# EAGLE design hackerspace_amped (EAGLE 5.12)
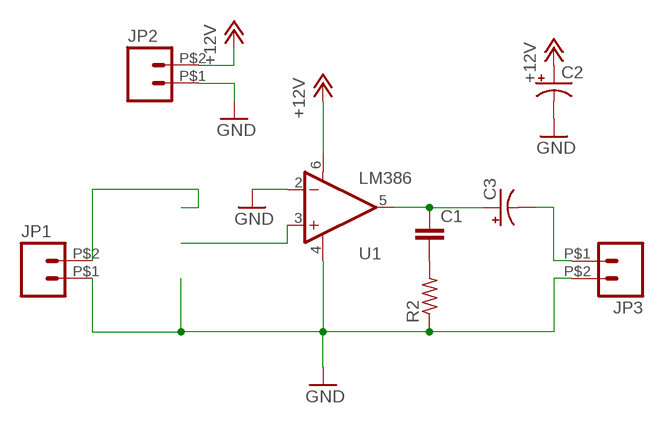
[diagram p0: schematic, sheet 1]

## Parts
C1  CAPPTH1  [CAP-PTH-5MM]
C2  CPOL-USE5-8.5  [E5-8,5]
C3  CPOL-USE22-6AXIAL  [E22-6]
JP1  M02PTH2  [1X02_BIG]
JP2  M02PTH2  [1X02_BIG]
JP3  M02PTH2  [1X02_BIG]
R2  R-US_0204/5  [0204/5]
U1  LM386  [DIP08]

## Nets
+12V: C2.+ JP2.P$2 U1.6(V+)
GND: C2.- JP1.P$1 JP2.P$1 JP3.P$2 R2.1 U1.2(-IN) U1.4(V-)
N$1: U1.3(+IN)
N$2: JP1.P$2
N$3: C1.1 C3.+ U1.5(OUT)
N$4: C3.- JP3.P$1
N$5: C1.2 R2.2

## Library data of the parts
C1 = SparkFun:CAP: Capacitor Standard 0603 ceramic capacitor, and 0.1" leaded capacitor.
C2 C3 = rcl:CPOL-US: POLARIZED CAPACITOR, American symbol
JP1-JP3 = SparkFun:M02: Header 2 Standard 2-pin 0.1" header. Use with straight break away headers (SKU : PRT-00116), right angle break away headers (PRT-00553), swiss pins (PRT-00743), machine pins (PRT-00117), and female headers (PRT-00115). Molex polarized connector foot print use with SKU : PRT-08233 with associated crimp pins and housings.
R2 = rcl:R-US_: RESISTOR, American symbol
U1 = SparkFun:LM386: low voltage audio power amplifier

## Board
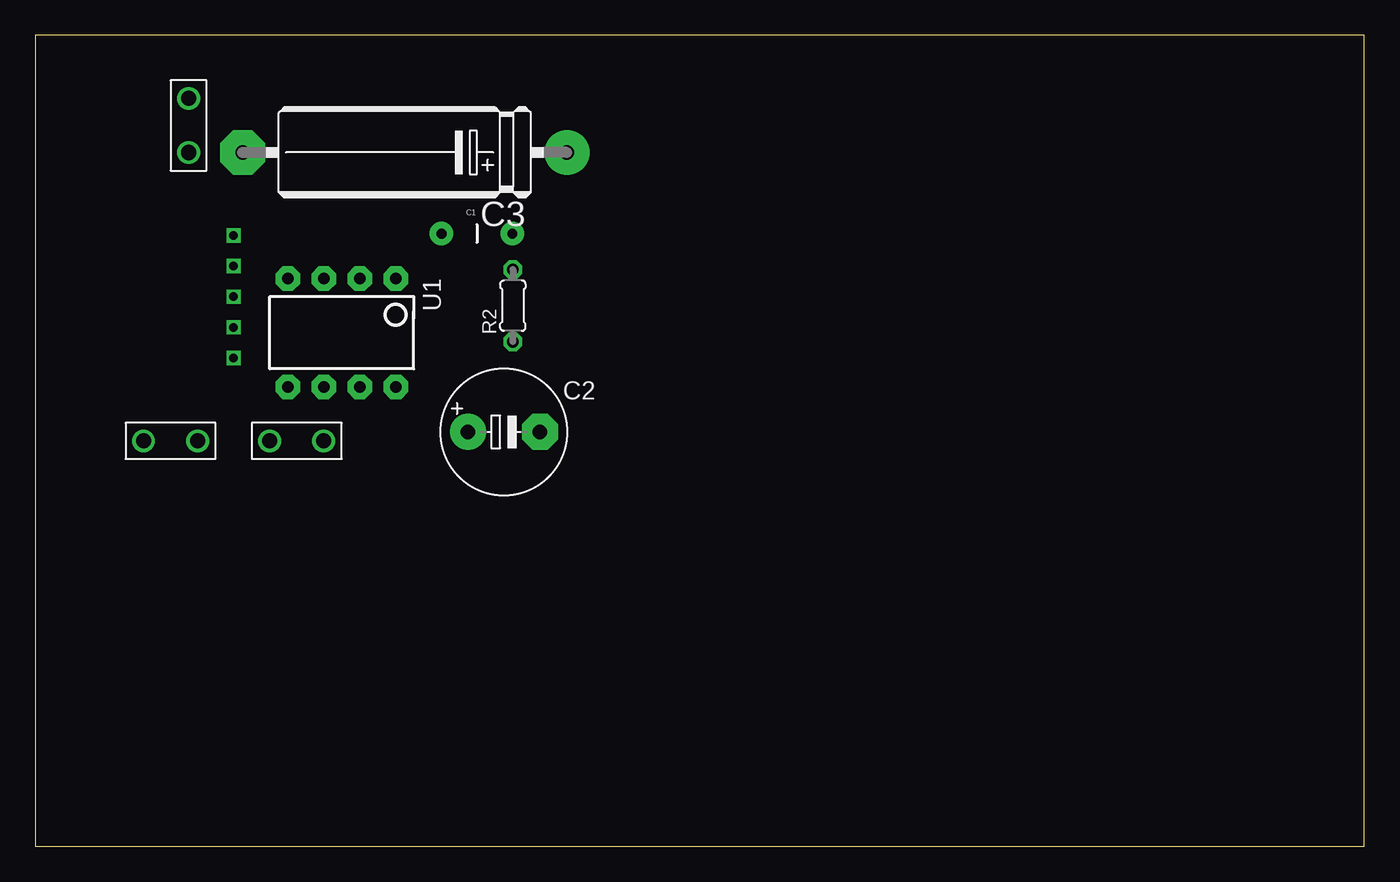
[diagram p1: board, top side]
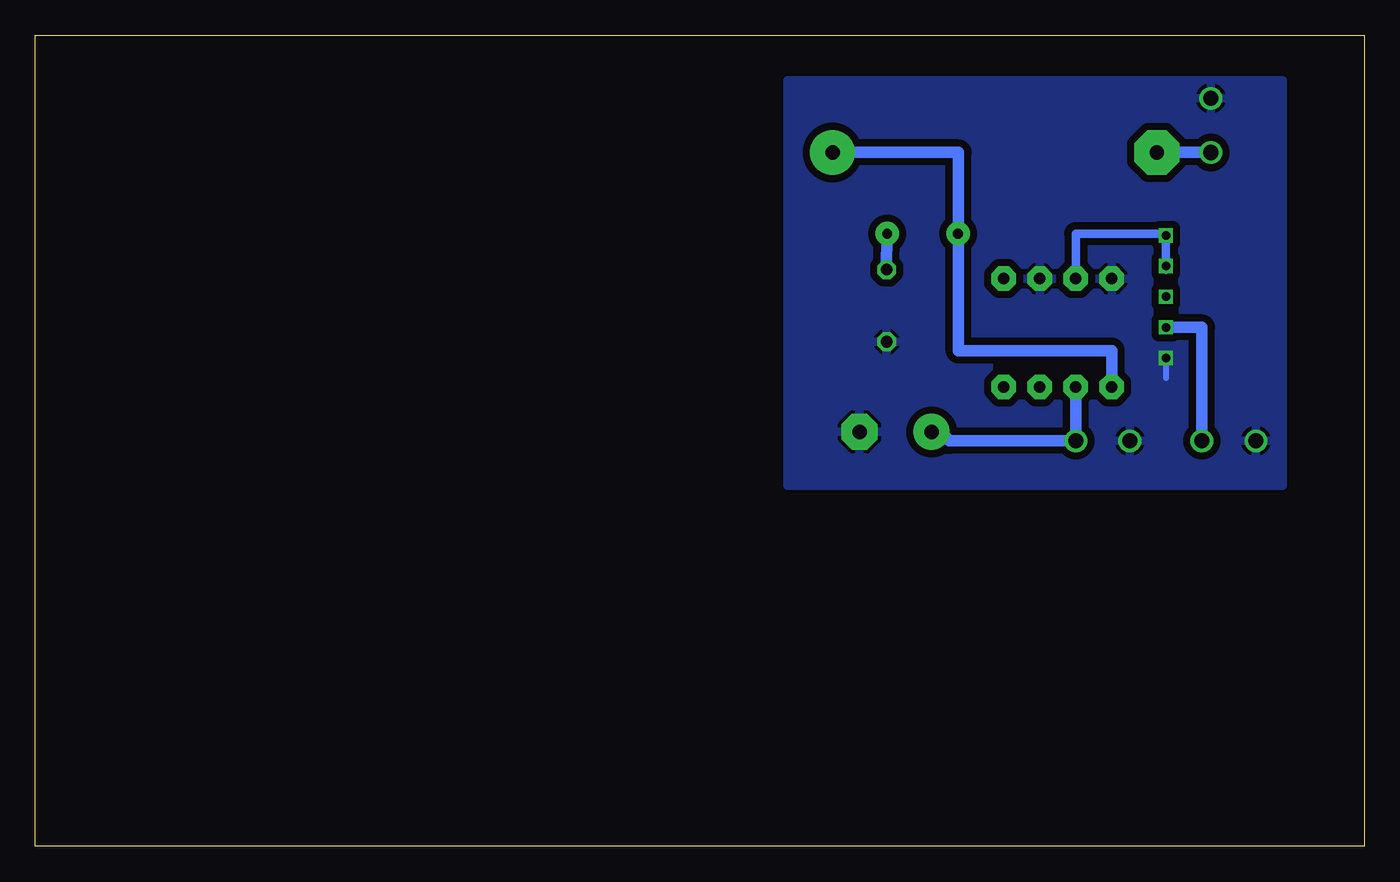
[diagram p2: board, bottom side, seen from below]

Size 93.65 x 57.14 mm. Coordinates in mm from the lower left corner, seen from the top.
Outline: 0,0 93.65,0 93.65,57.14 0,57.14 0,0
Copper layers (1*16): Top 0.035mm / dielectric 1.5mm / Bottom 0.035mm
Design rules "default *": minimum track width 10mil, minimum drill 24mil, track to track 20mil, track to pad 20mil, pad to pad 8mil, via to via 8mil, smd to smd 8mil, copper to edge 40mil, drill to drill 8mil, minimum pad ring 10mil, minimum via ring 8mil, stop-mask expansion 4mil, vias tented up to drill 0mil, thermal gap 10mil

### Footprints (pad centres in the part's own frame; a part is rotated, then mirrored left to right if it is on the bottom)
CAP-PTH-5MM = drill 0.7 pad 1.651 round: 1 -2.5,0; 2 2.5,0
E5-8,5 = drill 1.016 pad 2.54 round: + -2.54,0 | drill 1.016 pad 2.54 octagon: - 2.54,0
E22-6 = drill 1.016 pad 3.15 round: + -11.43,0 | drill 1.016 pad 3.15 octagon: - 11.43,0
1X02_BIG = drill 1.067 round: P$1 0,0; P$2 3.81,0
0204/5 = drill 0.813 octagon: 1 -2.54,0; 2 2.54,0
DIP08 = drill 0.813 pad 1.727 octagon: 1 -3.81,-3.81; 2 -1.27,-3.81; 3 1.27,-3.81; 4 3.81,-3.81; 5 3.81,3.81; 6 1.27,3.81; 7 -1.27,3.81; 8 -3.81,3.81

### Placement (x,y rotation side)
C1  31.11,43.18 0 top
C2  33.02,29.21 0 top
C3  26.04,48.9 180 top
JP1  7.62,28.57 0 top
JP2  16.51,28.57 0 top
JP3  10.79,48.9 90 top
R2  33.66,38.1 90 top
U1  21.59,36.2 180 top

### Tracks (layer width: path | path; a pad name or v marks a point on that pad's centre or on a via)
+12V
  Bottom 0.254: JP2.P$2 20.32,27.94
  Bottom 0.813: U1.6 JP2.P$2 29.21,28.57 29.84,29.21 C2.+
GND  (via drill 0.6)
  Bottom 0.406: v13.97,34.42 13.97,33.02
  pour Bottom: 5.71,53.98 40.64,53.98 40.64,25.4 5.71,25.4
N$1  (via drill 0.6)
  Bottom 0.61: U1.3 20.32,43.18 13.97,43.18 v13.97,43.05 13.97,40.64
N$2  (via drill 0.6)
  Bottom 0.813: v13.97,36.58 11.43,36.58 JP1.P$2
N$3
  Bottom 0.61: 28.57,34.92 C1.1
  Bottom 0.813: U1.5 17.78,34.92 28.57,34.92 28.57,48.9 C3.+
N$4
  Bottom 0.813: JP3.P$1 C3.-
N$5
  Bottom 0.813: R2.2 C1.2
N$6  (via drill 0.6)
  other vias: 13.97,40.89
N$10  (via drill 0.6)
  other vias: 13.97,38.73